# EAGLE design nandboard (EAGLE 7.2.0)
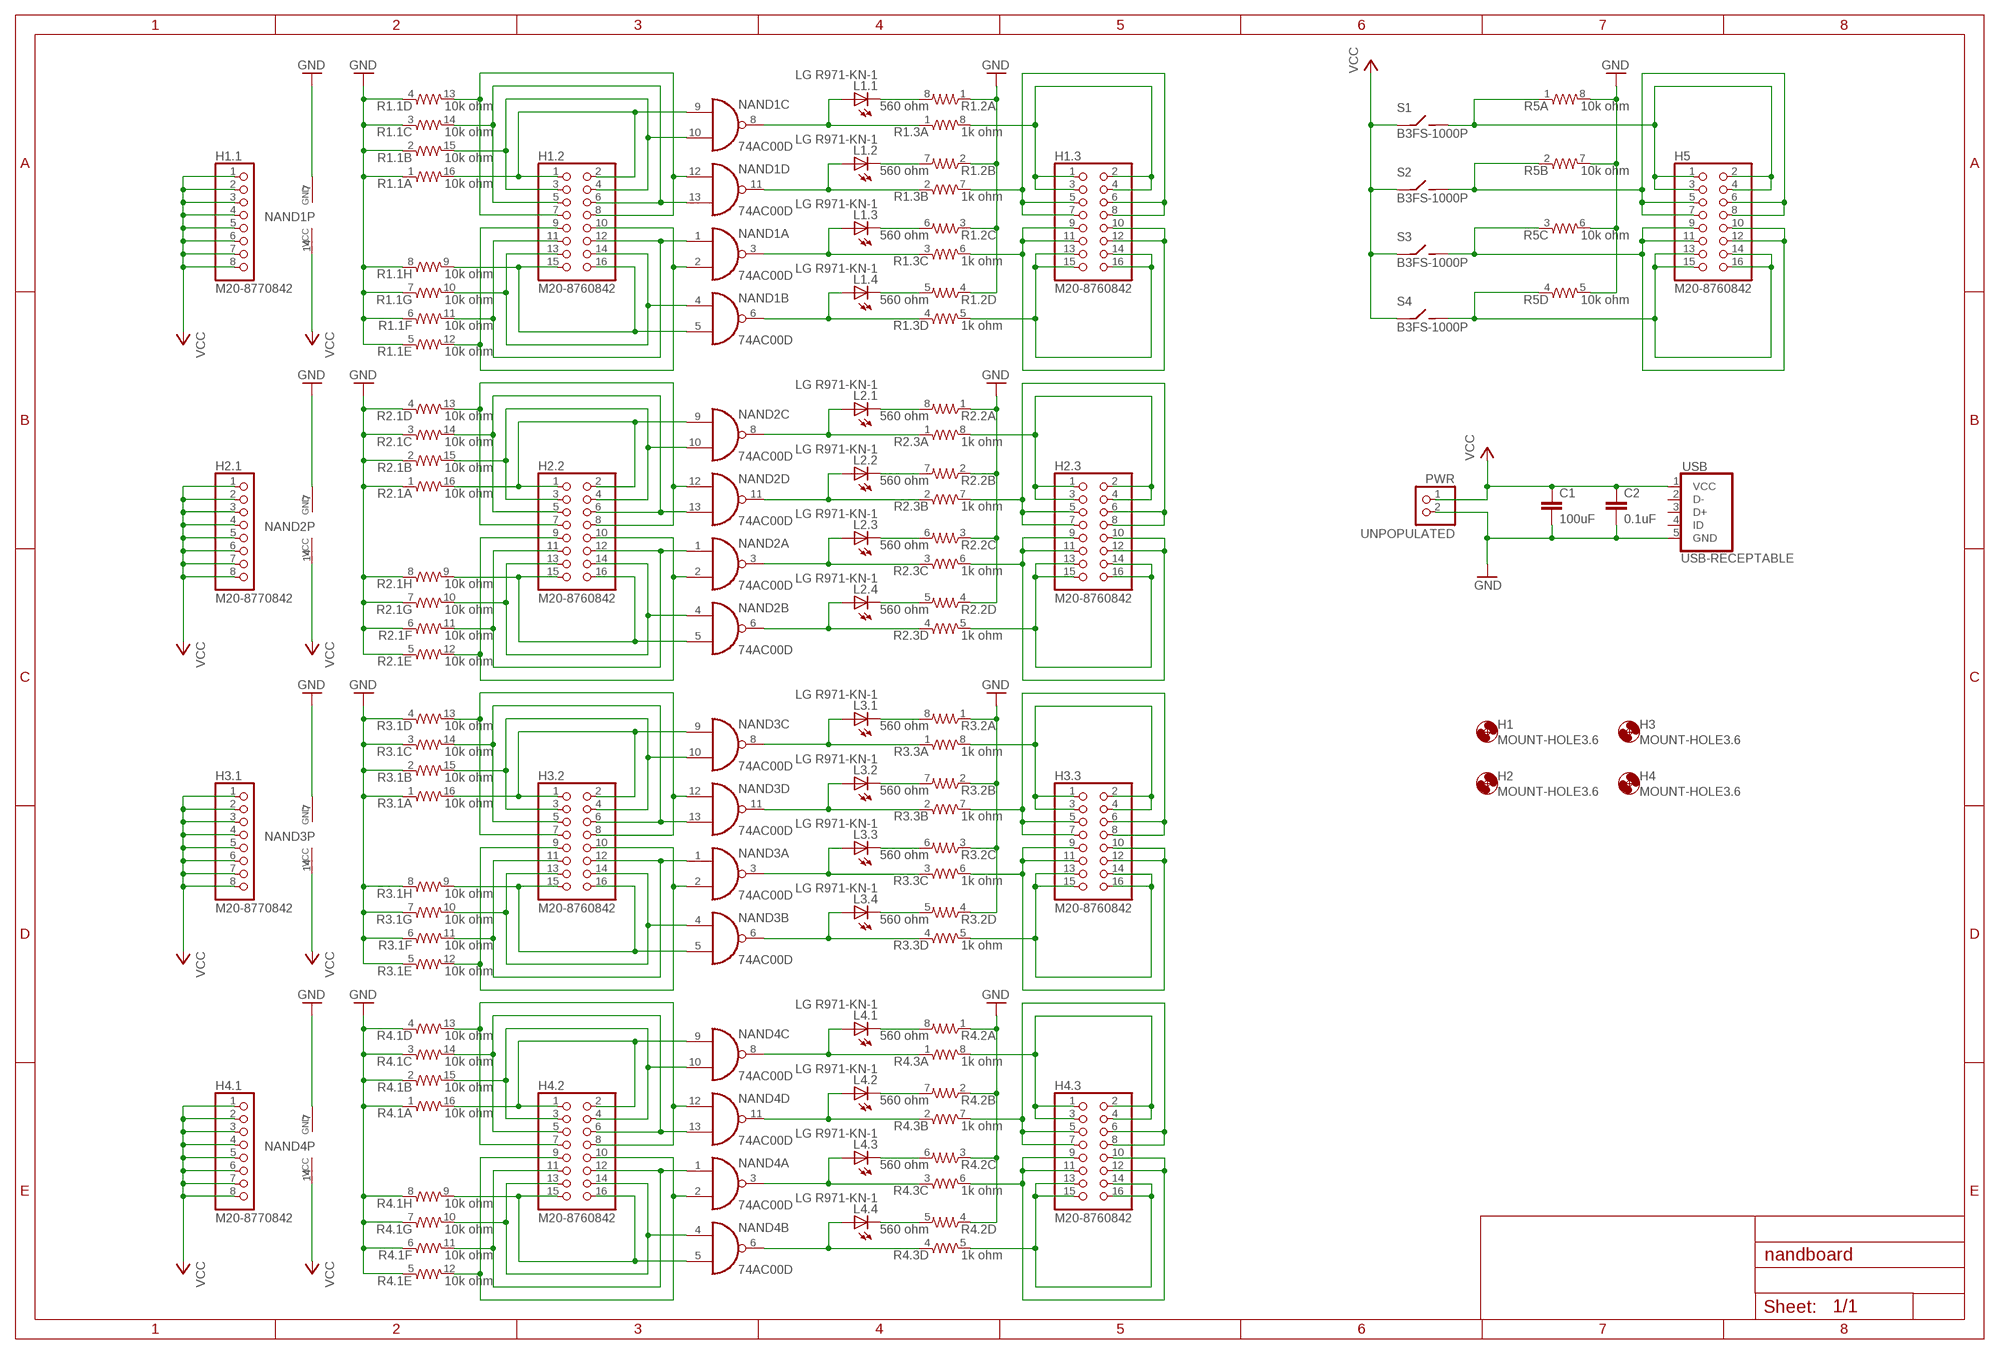
[diagram p0: schematic, sheet 1]

## Parts
C1  100uF  C-EUC1210  [C1210]
C2  0.1uF  C-EUC0805  [C0805]
H1  MOUNT-HOLE3.6  [3,6]
H1.1  M20-8770842  PINHD-1X81X08_SMT  [1X08_SMT]
H1.2  M20-8760842  PINHD-2X8SMT  [2X08_SMT]
H1.3  M20-8760842  PINHD-2X8SMT  [2X08_SMT]
H2  MOUNT-HOLE3.6  [3,6]
H2.1  M20-8770842  PINHD-1X81X08_SMT  [1X08_SMT]
H2.2  M20-8760842  PINHD-2X8SMT  [2X08_SMT]
H2.3  M20-8760842  PINHD-2X8SMT  [2X08_SMT]
H3  MOUNT-HOLE3.6  [3,6]
H3.1  M20-8770842  PINHD-1X81X08_SMT  [1X08_SMT]
H3.2  M20-8760842  PINHD-2X8SMT  [2X08_SMT]
H3.3  M20-8760842  PINHD-2X8SMT  [2X08_SMT]
H4  MOUNT-HOLE3.6  [3,6]
H4.1  M20-8770842  PINHD-1X81X08_SMT  [1X08_SMT]
H4.2  M20-8760842  PINHD-2X8SMT  [2X08_SMT]
H4.3  M20-8760842  PINHD-2X8SMT  [2X08_SMT]
H5  M20-8760842  PINHD-2X8SMT  [2X08_SMT]
L1.1  LG R971-KN-1  LEDCHIPLED_0805  [CHIPLED_0805]
L1.2  LG R971-KN-1  LEDCHIPLED_0805  [CHIPLED_0805]
L1.3  LG R971-KN-1  LEDCHIPLED_0805  [CHIPLED_0805]
L1.4  LG R971-KN-1  LEDCHIPLED_0805  [CHIPLED_0805]
L2.1  LG R971-KN-1  LEDCHIPLED_0805  [CHIPLED_0805]
L2.2  LG R971-KN-1  LEDCHIPLED_0805  [CHIPLED_0805]
L2.3  LG R971-KN-1  LEDCHIPLED_0805  [CHIPLED_0805]
L2.4  LG R971-KN-1  LEDCHIPLED_0805  [CHIPLED_0805]
L3.1  LG R971-KN-1  LEDCHIPLED_0805  [CHIPLED_0805]
L3.2  LG R971-KN-1  LEDCHIPLED_0805  [CHIPLED_0805]
L3.3  LG R971-KN-1  LEDCHIPLED_0805  [CHIPLED_0805]
L3.4  LG R971-KN-1  LEDCHIPLED_0805  [CHIPLED_0805]
L4.1  LG R971-KN-1  LEDCHIPLED_0805  [CHIPLED_0805]
L4.2  LG R971-KN-1  LEDCHIPLED_0805  [CHIPLED_0805]
L4.3  LG R971-KN-1  LEDCHIPLED_0805  [CHIPLED_0805]
L4.4  LG R971-KN-1  LEDCHIPLED_0805  [CHIPLED_0805]
NAND1  74AC00D  [SO14]
NAND2  74AC00D  [SO14]
NAND3  74AC00D  [SO14]
NAND4  74AC00D  [SO14]
PWR  UNPOPULATED  PINHD-1X2  [1X02]
R1.1  10k ohm  742-16_S  [742-16]
R1.2  560 ohm  742-8_S  [742-8]
R1.3  1k ohm  742-8_S  [742-8]
R2.1  10k ohm  742-16_S  [742-16]
R2.2  560 ohm  742-8_S  [742-8]
R2.3  1k ohm  742-8_S  [742-8]
R3.1  10k ohm  742-16_S  [742-16]
R3.2  560 ohm  742-8_S  [742-8]
R3.3  1k ohm  742-8_S  [742-8]
R4.1  10k ohm  742-16_S  [742-16]
R4.2  560 ohm  742-8_S  [742-8]
R4.3  1k ohm  742-8_S  [742-8]
R5  10k ohm  742-8_S  [742-8]
S1  B3FS-1000P  SPSTB3FS-1000  [B3FS-1000]
S2  B3FS-1000P  SPSTB3FS-1000  [B3FS-1000]
S3  B3FS-1000P  SPSTB3FS-1000  [B3FS-1000]
S4  B3FS-1000P  SPSTB3FS-1000  [B3FS-1000]
USB  USB-RECEPTABLE  [FCI-10103594-0001LF]

## Nets
GND: C1.2 C2.2 NAND1.7(P:GND) NAND2.7(P:GND) NAND3.7(P:GND) NAND4.7(P:GND) PWR.2 R1.1.1 R1.1.2 R1.1.3 R1.1.4 R1.1.5 R1.1.6 R1.1.7 R1.1.8 R1.2.1 R1.2.2 R1.2.3 R1.2.4 R2.1.1 R2.1.2 R2.1.3 R2.1.4 R2.1.5 R2.1.6 R2.1.7 R2.1.8 R2.2.1 R2.2.2 R2.2.3 R2.2.4 R3.1.1 R3.1.2 R3.1.3 R3.1.4 R3.1.5 R3.1.6 R3.1.7 R3.1.8 R3.2.1 R3.2.2 R3.2.3 R3.2.4 R4.1.1 R4.1.2 R4.1.3 R4.1.4 R4.1.5 R4.1.6 R4.1.7 R4.1.8 R4.2.1 R4.2.2 R4.2.3 R4.2.4 R5.5 R5.6 R5.7 R5.8 USB.5(GND)
N$1: H2.2.1 H2.2.2 NAND2.9(C:I0) R2.1.16
N$2: H2.2.3 H2.2.4 NAND2.10(C:I1) R2.1.15
N$3: H5.1 H5.2 H5.3 H5.4 R5.1 S1.3(B) S1.4(B)
N$4: H2.2.5 H2.2.6 NAND2.13(D:I1) R2.1.14
N$5: H2.2.7 H2.2.8 NAND2.12(D:I0) R2.1.13
N$6: H5.5 H5.6 H5.7 H5.8 R5.2 S2.3(B) S2.4(B)
N$7: H5.9 H5.10 H5.11 H5.12 R5.3 S3.3(B) S3.4(B)
N$8: H5.13 H5.14 H5.15 H5.16 R5.4 S4.3(B) S4.4(B)
N$9: H2.2.15 H2.2.16 NAND2.5(B:I1) R2.1.9
N$10: H2.2.13 H2.2.14 NAND2.4(B:I0) R2.1.10
N$11: H2.2.11 H2.2.12 NAND2.1(A:I0) R2.1.11
N$12: H2.2.9 H2.2.10 NAND2.2(A:I1) R2.1.12
N$13: L1.4.C R1.2.5
N$14: L1.3.C R1.2.6
N$15: L1.2.C R1.2.7
N$16: L1.1.C R1.2.8
N$17: H2.3.13 H2.3.14 H2.3.15 H2.3.16 R2.3.5
N$18: H2.3.9 H2.3.10 H2.3.11 H2.3.12 R2.3.6
N$19: H2.3.1 H2.3.2 H2.3.3 H2.3.4 R2.3.8
N$20: H2.3.5 H2.3.6 H2.3.7 H2.3.8 R2.3.7
N$21: H1.2.1 H1.2.2 NAND1.9(C:I0) R1.1.16
N$22: H1.2.3 H1.2.4 NAND1.10(C:I1) R1.1.15
N$23: H1.2.5 H1.2.6 NAND1.13(D:I1) R1.1.14
N$24: H1.2.7 H1.2.8 NAND1.12(D:I0) R1.1.13
N$25: H1.3.13 H1.3.14 H1.3.15 H1.3.16 R1.3.5
N$26: H1.3.9 H1.3.10 H1.3.11 H1.3.12 R1.3.6
N$27: L1.1.A NAND1.8(C:O) R1.3.1
N$28: H1.3.1 H1.3.2 H1.3.3 H1.3.4 R1.3.8
N$29: H1.2.15 H1.2.16 NAND1.5(B:I1) R1.1.9
N$30: H1.2.13 H1.2.14 NAND1.4(B:I0) R1.1.10
N$31: H1.2.11 H1.2.12 NAND1.1(A:I0) R1.1.11
N$32: H1.2.9 H1.2.10 NAND1.2(A:I1) R1.1.12
N$33: L1.2.A NAND1.11(D:O) R1.3.2
N$34: H1.3.5 H1.3.6 H1.3.7 H1.3.8 R1.3.7
N$35: L1.3.A NAND1.3(A:O) R1.3.3
N$36: L1.4.A NAND1.6(B:O) R1.3.4
N$37: L2.1.A NAND2.8(C:O) R2.3.1
N$38: L2.2.A NAND2.11(D:O) R2.3.2
N$39: L2.3.A NAND2.3(A:O) R2.3.3
N$40: L2.4.A NAND2.6(B:O) R2.3.4
N$41: L2.1.C R2.2.8
N$42: L2.2.C R2.2.7
N$43: L2.3.C R2.2.6
N$44: L2.4.C R2.2.5
N$45: H3.2.1 H3.2.2 NAND3.9(C:I0) R3.1.16
N$46: H3.2.3 H3.2.4 NAND3.10(C:I1) R3.1.15
N$47: H3.2.5 H3.2.6 NAND3.13(D:I1) R3.1.14
N$48: H3.2.7 H3.2.8 NAND3.12(D:I0) R3.1.13
N$49: H3.2.15 H3.2.16 NAND3.5(B:I1) R3.1.9
N$50: H3.2.13 H3.2.14 NAND3.4(B:I0) R3.1.10
N$51: H3.2.11 H3.2.12 NAND3.1(A:I0) R3.1.11
N$52: H3.2.9 H3.2.10 NAND3.2(A:I1) R3.1.12
N$53: H3.3.13 H3.3.14 H3.3.15 H3.3.16 R3.3.5
N$54: H3.3.9 H3.3.10 H3.3.11 H3.3.12 R3.3.6
N$55: H3.3.1 H3.3.2 H3.3.3 H3.3.4 R3.3.8
N$56: H3.3.5 H3.3.6 H3.3.7 H3.3.8 R3.3.7
N$57: L3.1.A NAND3.8(C:O) R3.3.1
N$58: L3.2.A NAND3.11(D:O) R3.3.2
N$59: L3.3.A NAND3.3(A:O) R3.3.3
N$60: L3.4.A NAND3.6(B:O) R3.3.4
N$61: L3.4.C R3.2.5
N$62: L3.3.C R3.2.6
N$63: L3.2.C R3.2.7
N$64: L3.1.C R3.2.8
N$65: H4.2.1 H4.2.2 NAND4.9(C:I0) R4.1.16
N$66: H4.2.3 H4.2.4 NAND4.10(C:I1) R4.1.15
N$67: H4.2.5 H4.2.6 NAND4.13(D:I1) R4.1.14
N$68: H4.2.7 H4.2.8 NAND4.12(D:I0) R4.1.13
N$69: H4.2.15 H4.2.16 NAND4.5(B:I1) R4.1.9
N$70: H4.2.13 H4.2.14 NAND4.4(B:I0) R4.1.10
N$71: H4.2.11 H4.2.12 NAND4.1(A:I0) R4.1.11
N$72: H4.2.9 H4.2.10 NAND4.2(A:I1) R4.1.12
N$73: H4.3.13 H4.3.14 H4.3.15 H4.3.16 R4.3.5
N$74: H4.3.9 H4.3.10 H4.3.11 H4.3.12 R4.3.6
N$75: H4.3.1 H4.3.2 H4.3.3 H4.3.4 R4.3.8
N$76: H4.3.5 H4.3.6 H4.3.7 H4.3.8 R4.3.7
N$77: L4.1.A NAND4.8(C:O) R4.3.1
N$78: L4.2.A NAND4.11(D:O) R4.3.2
N$79: L4.3.A NAND4.3(A:O) R4.3.3
N$80: L4.4.A NAND4.6(B:O) R4.3.4
N$81: L4.1.C R4.2.8
N$82: L4.2.C R4.2.7
N$83: L4.3.C R4.2.6
N$84: L4.4.C R4.2.5
VCC: C1.1 C2.1 H1.1.1 H1.1.2 H1.1.3 H1.1.4 H1.1.5 H1.1.6 H1.1.7 H1.1.8 H2.1.1 H2.1.2 H2.1.3 H2.1.4 H2.1.5 H2.1.6 H2.1.7 H2.1.8 H3.1.1 H3.1.2 H3.1.3 H3.1.4 H3.1.5 H3.1.6 H3.1.7 H3.1.8 H4.1.1 H4.1.2 H4.1.3 H4.1.4 H4.1.5 H4.1.6 H4.1.7 H4.1.8 NAND1.14(P:VCC) NAND2.14(P:VCC) NAND3.14(P:VCC) NAND4.14(P:VCC) PWR.1 S1.1(A) S1.2(A) S2.1(A) S2.2(A) S3.1(A) S3.2(A) S4.1(A) S4.2(A) USB.1(VCC)
Unconnected: USB.2(D-) USB.3(D+) USB.4(ID)

## Library data of the parts
C1 C2 = rcl:C-EU: CAPACITOR, European symbol
H1-H4 = holes:MOUNT-HOLE: MOUNTING HOLE with drill center marker
H1.1 H2.1 H3.1 H4.1 = pinhead+:PINHD-1X8: PIN HEADER
H1.2 H1.3 H2.2 H2.3 H3.2 H3.3 H4.2 H4.3 H5 = pinhead+:PINHD-2X8: PIN HEADER
L1.1-L1.4 L2.1-L2.4 L3.1-L3.4 L4.1-L4.4 = led:LED: LED OSRAM: - CHIPLED LG R971, LG N971, LY N971, LG Q971, LY Q971, LO R971, LY R971 LH N974, LH R974 LS Q976, LO Q976, LY Q976 LO Q996 - Hyper CHIPLED LW Q18S LB Q993, LB Q99A, LB R99A - SideLED LS A670, LO A670, LY A670, LG A670, LP A670 LB A673, LV A673, LT A673, LW A673 LH A674 LY A675 LS A676, LA A676, LO A676, LY A676, LW A676 LS A679, LY A679, LG A679 - Hyper Micro SIDELED® LS Y876, LA Y876, LO Y876, LY Y876 LT Y87S - SmartLED LW L88C, LW L88S LB L89C, LB L89S, LG L890 LS L89K, LO L89K, LY L89K LS L896, LA L896, LO L896, LY L896 - TOPLED LS T670, LO T670, LY T670, LG T670, LP T670 LSG T670, LSP T670, LSY T670, LOP T670, LYG T670 LG T671, LOG T671, LSG T671 LB T673, LV T673, LT T673, LW T673 LH T674 LS T676, LA T676, LO T676, LY T676, LB T676, LH T676, LSB T676, LW T676 LB T67C, LV T67C, LT T67C, LS T67K, LO T67K, LY T67K, LW E67C LS E67B, LA E67B, LO E67B, LY E67B, LB E67C, LV E67C, LT E67C LW T67C LS T679, LY T679, LG T679 LS T770, LO T770, LY T770, LG T770, LP T770 LB T773, LV T773, LT T773, LW T773 LH T774 LS E675, LA E675, LY E675, LS T675 LS T776, LA T776, LO T776, LY T776, LB T776 LHGB T686 LT T68C, LB T68C - Hyper Mini TOPLED® LB M676 - Mini TOPLED Santana® LG M470 LS M47K, LO M47K, LY M47K Source: http://www.osram.convergy.de LUXEON: - LUMILED® LXK2-PW12-R00, LXK2-PW12-S00, LXK2-PW14-U00, LXK2-PW14-V00 LXK2-PM12-R00, LXK2-PM12-S00, LXK2-PM14-U00 LXK2-PE12-Q00, LXK2-PE12-R00, LXK2-PE12-S00, LXK2-PE14-T00, LXK2-PE14-U00 LXK2-PB12-K00, LXK2-PB12-L00, LXK2-PB12-M00, LXK2-PB14-N00, LXK2-PB14-P00, LXK2-PB14-Q00 LXK2-PR12-L00, LXK2-PR12-M00, LXK2-PR14-Q00, LXK2-PR14-R00 LXK2-PD12-Q00, LXK2-PD12-R00, LXK2-PD12-S00 LXK2-PH12-R00, LXK2-PH12-S00 LXK2-PL12-P00, LXK2-PL12-Q00, LXK2-PL12-R00 Source: www.luxeon.com KINGBRIGHT: KA-3528ASYC Source: www.kingbright.com
NAND1-NAND4 = 74xx-eu:74*00: Quad 2-input NAND gate
PWR = pinhead:PINHD-1X2: PIN HEADER
R1.1 R2.1 R3.1 R4.1 = resistor-array:742-16_S: CTS 742 Series 16 Terminations, 8 Resistors
R1.2 R1.3 R2.2 R2.3 R3.2 R3.3 R4.2 R4.3 R5 = resistor-array:742-8_S: CTS 742 Series 8 Terminations, 4 Resistors
S1-S4 = PP_Electromechanical:SPST: SPST Switches
USB = daspilker:USB-RECEPTABLE: USB Receptable

## Board
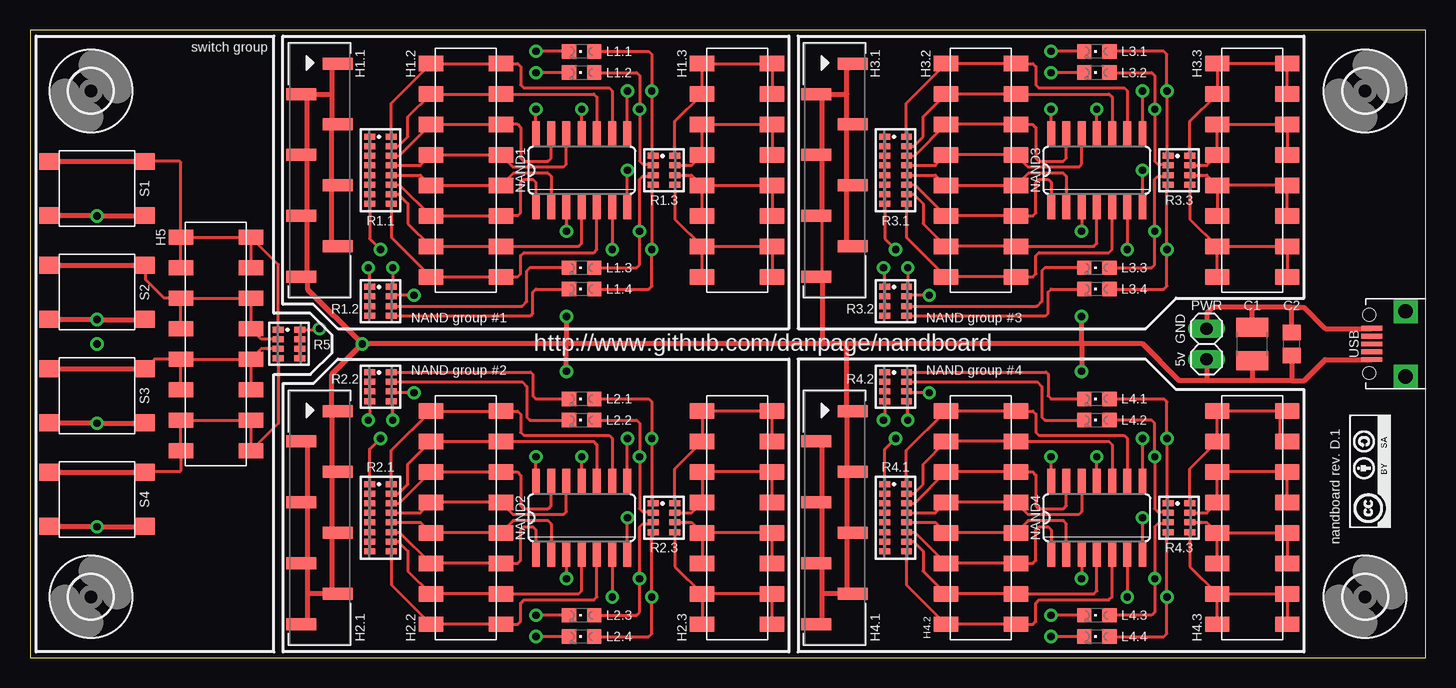
[diagram p1: board, top side]
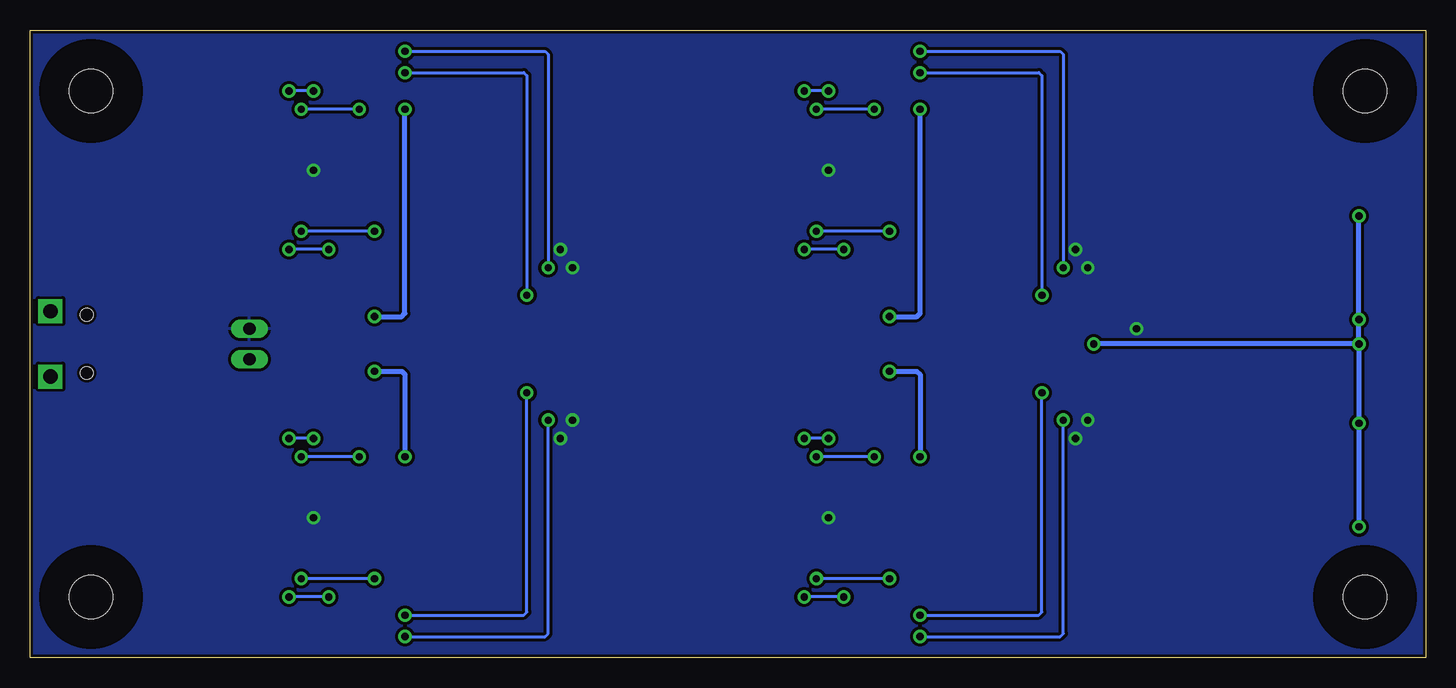
[diagram p2: board, bottom side, seen from below]

Size 116.33 x 52.32 mm. Coordinates in mm from the lower left corner, seen from the top.
Outline: 0,0 116.33,0 116.33,52.32 0,52.32 0,0
Copper layers (1*16): Top 0.035mm / dielectric 1.5mm / Bottom 0.035mm
Design rules "pcbtrain": minimum track width 0.2mm, minimum drill 0.4mm, track to track 0.2mm, track to pad 0.2mm, pad to pad 0.2mm, via to via 0.2mm, smd to smd 0mil, copper to edge 10mil, drill to drill 0.2mm, minimum pad ring 10mil, minimum via ring 10mil, stop-mask expansion 0.125mm, vias tented up to drill 0mil, thermal gap 10mil

### Footprints (pad centres in the part's own frame; a part is rotated, then mirrored left to right if it is on the bottom)
C1210 = smd 1.6 x 2.7: 1 -1.4,0; 2 1.4,0
C0805 = smd 1.3 x 1.5: 1 -0.95,0; 2 0.95,0
3,6 = hole 3.6: 0,0
1X08_SMT = smd 1 x 2.5: 1 -8.89,1.52; 2 -6.35,-1.52; 3 -3.81,1.52; 4 -1.27,-1.52; 5 1.27,1.52; 6 3.81,-1.52; 7 6.35,1.52; 8 8.89,-1.52
2X08_SMT = smd 1.27 x 2.032: 1 -8.89,-2.921; 2 -8.89,2.921; 3 -6.35,-2.921; 4 -6.35,2.921; 5 -3.81,-2.921; 6 -3.81,2.921; 7 -1.27,-2.921; 8 -1.27,2.921; 9 1.27,-2.921; 10 1.27,2.921; 11 3.81,-2.921; 12 3.81,2.921; 13 6.35,-2.921; 14 6.35,2.921; 15 8.89,-2.921; 16 8.89,2.921
CHIPLED_0805 = smd 1.2 x 1.2: A 0,-1.05; C 0,1.05
SO14 = smd 0.66 x 2.032: 1 -3.81,-3.073; 2 -2.54,-3.073; 3 -1.27,-3.073; 4 0,-3.073; 5 1.27,-3.073; 6 2.54,-3.073; 7 3.81,-3.073; 8 3.81,3.073; 9 2.54,3.073; 10 1.27,3.073; 11 0,3.073; 12 -1.27,3.073; 13 -2.54,3.073; 14 -3.81,3.073
1X02 = drill 1.016 long: 1 -1.27,0; 2 1.27,0
742-16 = smd 0.5 x 0.9: 1 -2.8,-0.9; 2 -2,-0.9; 3 -1.2,-0.9; 4 -0.4,-0.9; 5 0.4,-0.9; 6 1.2,-0.9; 7 2,-0.9; 8 2.8,-0.9; 9 2.8,0.9; 10 2,0.9; 11 1.2,0.9; 12 0.4,0.9; 13 -0.4,0.9; 14 -1.2,0.9; 15 -2,0.9; 16 -2.8,0.9
742-8 = smd 0.5 x 0.9: 1 -1.2,-0.9; 2 -0.4,-0.9; 3 0.4,-0.9; 4 1.2,-0.9; 5 1.2,0.9; 6 0.4,0.9; 7 -0.4,0.9; 8 -1.2,0.9
B3FS-1000 = smd 1.6 x 1.4: 1 4,-2.25; 2 -4,-2.25; 3 4,2.25; 4 -4,2.25
FCI-10103594-0001LF = smd 0.4 x 1.75: 1 -1.3,4.525; 2 -0.65,4.525; 3 0,4.525; 4 0.65,4.525; 5 1.3,4.525 | drill 1.2 pad 2 square: P$3 -2.725,1.7; P$4 2.725,1.7 | hole 1.05: -2.425,4.73; 2.425,4.73

### Placement (x,y rotation side)
C1  101.85,26.16 90 top
C2  105.16,26.16 90 top
H1  5.08,5.08 0 top
H1.1  24.13,40.64 270 top
H1.2  36.32,40.64 270 top
H1.3  58.93,40.64 270 top
H2  5.08,47.24 0 top
H2.1  24.13,11.68 270 top
H2.2  36.32,11.68 270 top
H2.3  58.93,11.68 270 top
H3  111.25,5.08 0 top
H3.1  67.06,40.64 270 top
H3.2  79.25,40.64 270 top
H3.3  101.85,40.64 270 top
H4  111.25,47.24 0 top
H4.1  67.06,11.68 270 top
H4.2  79.25,11.68 270 top
H4.3  101.85,11.68 270 top
H5  15.49,26.16 270 top
L1.1  45.97,50.55 90 top
L1.2  45.97,48.77 90 top
L1.3  45.97,32.51 90 top
L1.4  45.97,30.73 90 top
L2.1  45.97,21.59 90 top
L2.2  45.97,19.81 90 top
L2.3  45.97,3.56 90 top
L2.4  45.97,1.78 90 top
L3.1  88.9,50.55 90 top
L3.2  88.9,48.77 90 top
L3.3  88.9,32.51 90 top
L3.4  88.9,30.73 90 top
L4.1  88.9,21.59 90 top
L4.2  88.9,19.81 90 top
L4.3  88.9,3.56 90 top
L4.4  88.9,1.78 90 top
NAND1  45.97,40.64 0 top
NAND2  45.97,11.68 0 top
NAND3  88.9,40.64 0 top
NAND4  88.9,11.68 0 top
PWR  98.04,26.16 90 top
R1.1  29.21,40.64 270 top
R1.2  29.21,29.72 270 top
R1.3  52.83,40.64 270 top
R2.1  29.21,11.68 270 top
R2.2  29.21,22.61 270 top
R2.3  52.83,11.68 270 top
R3.1  72.14,40.64 270 top
R3.2  72.14,29.72 270 top
R3.3  95.76,40.64 270 top
R4.1  72.14,11.68 270 top
R4.2  72.14,22.61 270 top
R4.3  95.76,11.68 270 top
R5  21.59,26.16 270 top
S1  5.59,39.12 0 top
S2  5.59,30.48 0 top
S3  5.59,21.84 0 top
S4  5.59,13.21 0 top
USB  116.33,26.16 90 top

### Tracks (layer width: path | path; a pad name or v marks a point on that pad's centre or on a via)
GND  (via drill 0.6)
  Top 0.254: NAND1.7 v49.78,40.64 | NAND3.7 v92.71,40.64 | NAND4.7 v92.71,11.68 | NAND2.7 v49.78,11.68 | v28.19,19.81 28.31,19.93 R2.2.4 R2.2.3 R2.2.2 R2.2.1 | R2.1.8 R2.1.7 R2.1.6 R2.1.5 R2.1.4 R2.1.3 R2.1.2 R2.1.1 28.31,17.39 v29.21,18.29 | R4.1.8 R4.1.7 R4.1.6 R4.1.5 R4.1.4 R4.1.3 R4.1.2 R4.1.1 71.24,17.39 v72.14,18.29 | R4.2.1 R4.2.2 R4.2.3 R4.2.4 71.24,19.93 v71.12,19.81 | R1.2.4 R1.2.3 R1.2.2 R1.2.1 28.31,32.4 v28.19,32.51 | R1.1.1 R1.1.2 R1.1.3 R1.1.4 R1.1.5 R1.1.6 R1.1.7 R1.1.8 28.31,34.94 v29.21,34.04 | R5.5 R5.6 R5.7 R5.8 24.06,27.36 v24.13,27.43 | R3.2.4 R3.2.3 R3.2.2 R3.2.1 71.24,32.4 v71.12,32.51 | v72.14,34.04 71.24,34.94 R3.1.8 R3.1.7 R3.1.6 R3.1.5 R3.1.4 R3.1.3 R3.1.2 R3.1.1
  Top 0.406: 105.16,29.21 101.85,29.21 | C2.2 105.16,29.21 | C1.2 101.85,29.21 | 101.85,29.21 98.55,29.21 98.04,28.7 PWR.2 | 105.16,29.21 106.17,29.21 107.95,27.43 111.78,27.43 USB.5
  pour Bottom (isolate 0.254): 0.25,0.25 0.25,52.07 116.08,52.07 116.08,0.25
N$1
  Top 0.254: NAND2.9 48.51,18.29 48.26,18.54 41.15,18.54 40.89,18.8 40.89,20.32 40.64,20.57 H2.2.2 H2.2.1 30.11,17.28 R2.1.16
N$2
  Top 0.254: NAND2.10 47.24,17.78 46.99,18.03 H2.2.4 H2.2.3 31.5,16.13 31.5,14.48 30.7,13.68 R2.1.15
N$3
  Top 0.254: H5.3 H5.1 | H5.1 H5.2 | H5.2 H5.4 | R5.1 20.69,32.78 H5.2 | H5.1 12.57,41.27 12.45,41.4 9.62,41.4 S1.3
  Top 0.406: S1.4 S1.3
N$4
  Top 0.254: NAND2.13 43.43,12.7 43.18,12.45 41.15,12.45 40.89,12.7 40.89,15.24 40.64,15.49 H2.2.6 H2.2.5 30.79,12.88 R2.1.14
N$5
  Top 0.254: NAND2.12 44.7,12.19 44.45,11.94 40.26,11.94 H2.2.8 H2.2.7 32.53,12.08 R2.1.13
N$6
  Top 0.254: H5.7 H5.5 | H5.5 H5.6 H5.8 19.29,26.56 R5.2 | H5.5 11.18,29.97 9.65,31.5 9.65,32.67 S2.3
  Top 0.406: S2.4 S2.3
N$7
  Top 0.254: H5.11 H5.9 | H5.9 H5.10 | H5.10 H5.12 | R5.3 19.29,25.76 H5.10 | 9.62,24.13 S3.3 10.39,24.89 H5.9
  Top 0.406: S3.4 S3.3
N$8
  Top 0.254: R5.4 20.69,19.55 H5.16 H5.14 H5.13 H5.15 12.57,15.62 12.45,15.49 9.62,15.49 S4.3
  Top 0.406: S4.4 S4.3
N$9
  Top 0.254: NAND2.5 47.24,5.08 46.99,4.83 41.15,4.83 40.89,4.57 40.89,3.05 40.64,2.79 H2.2.16 H2.2.15 30.11,6.08 R2.1.9
N$10
  Top 0.254: NAND2.4 45.97,5.59 45.72,5.33 H2.2.14 H2.2.13 31.5,7.24 31.5,8.89 30.7,9.68 R2.1.10
N$11
  Top 0.254: NAND2.1 42.16,10.67 41.91,10.92 41.15,10.92 40.89,10.67 40.89,8.13 40.64,7.87 H2.2.12 H2.2.11 30.79,10.48 R2.1.11
N$12
  Top 0.254: NAND2.2 43.43,11.18 43.18,11.43 40.26,11.43 H2.2.10 H2.2.9 32.53,11.28 R2.1.12
N$13
  Top 0.254: R1.2.5 41.73,28.52 41.91,28.7 41.91,30.48 42.16,30.73 L1.4.C
N$14
  Top 0.254: L1.3.C 41.66,32.51 41.4,32.26 41.4,29.72 41,29.32 R1.2.6
N$15  (via drill 0.6)
  Top 0.254: L1.2.C v42.16,48.77 | v32,30.23 30.22,30.23 R1.2.7
  Bottom 0.254: v42.16,48.77 32.26,48.77 32,48.51 v32,30.23
N$16  (via drill 0.6)
  Top 0.254: L1.1.C v42.16,50.55 | v30.23,32.51 30.23,31.03 R1.2.8
  Bottom 0.254: v42.16,50.55 30.48,50.55 30.23,50.29 v30.23,32.51
N$17
  Top 0.254: H2.3.16 H2.3.14 H2.3.13 | H2.3.13 H2.3.15 | R2.3.5 53.73,7.61 H2.3.13
N$18
  Top 0.254: H2.3.12 H2.3.10 H2.3.9 | H2.3.9 H2.3.11 | R2.3.6 55.14,11.28 H2.3.9
N$19
  Top 0.254: H2.3.4 H2.3.2 H2.3.1 H2.3.3 53.73,15.76 R2.3.8
N$20
  Top 0.254: H2.3.8 H2.3.6 H2.3.5 H2.3.7 55.14,12.08 R2.3.7
N$21
  Top 0.254: NAND1.9 48.51,47.24 48.26,47.5 41.15,47.5 40.89,47.75 40.89,49.28 40.64,49.53 H1.2.2 H1.2.1 30.11,46.24 R1.1.16
N$22
  Top 0.254: NAND1.10 47.24,46.74 46.99,46.99 H1.2.4 H1.2.3 31.5,45.09 31.5,43.43 30.7,42.64 R1.1.15
N$23
  Top 0.254: 39.88,44.45 H1.2.6 H1.2.5 30.79,41.84 R1.1.14 | 39.88,44.45 39.88,44.2 | NAND1.13 43.43,41.66 43.18,41.4 41.15,41.4 40.89,41.66 40.89,44.2 40.64,44.45 39.88,44.45
N$24
  Top 0.254: NAND1.12 44.7,41.15 44.45,40.89 40.26,40.89 H1.2.8 H1.2.7 32.53,41.04 R1.1.13
N$25
  Top 0.254: H1.3.15 H1.3.13 | H1.3.13 H1.3.14 H1.3.16 | R1.3.5 53.73,36.56 H1.3.13
N$26
  Top 0.254: H1.3.11 H1.3.9 | H1.3.9 H1.3.10 H1.3.12 | R1.3.6 55.14,40.24 H1.3.9
N$27  (via drill 0.6)
  Top 0.254: NAND1.8 v49.78,47.24 | L1.1.A 51.56,50.55 51.82,50.29 v51.82,47.24 51.82,41.96 R1.3.1
  Bottom 0.254: v49.78,47.24 v51.82,47.24
N$28
  Top 0.254: H1.3.4 H1.3.2 H1.3.1 H1.3.3 53.73,44.72 R1.3.8
N$29
  Top 0.254: NAND1.5 47.24,34.04 46.99,33.78 41.15,33.78 40.89,33.53 40.89,32 40.64,31.75 H1.2.16 H1.2.15 30.11,35.04 R1.1.9
N$30
  Top 0.254: NAND1.4 45.97,34.54 45.72,34.29 H1.2.14 H1.2.13 31.5,36.2 31.5,37.85 30.7,38.64 R1.1.10
N$31
  Top 0.254: H1.2.12 H1.2.11 30.79,39.44 R1.1.11 | H1.2.12 39.62,36.83 | NAND1.1 42.16,39.62 41.91,39.88 41.15,39.88 40.89,39.62 40.89,37.08 40.64,36.83 H1.2.12
N$32
  Top 0.254: NAND1.2 43.43,40.13 43.18,40.39 40.26,40.39 H1.2.10 H1.2.9 32.53,40.24 R1.1.12
N$33  (via drill 0.6)
  Top 0.254: NAND1.11 v45.97,45.72 | L1.2.A 50.55,48.77 50.8,48.51 v50.8,45.72 50.8,41.4 51.05,41.15 51.82,41.15 R1.3.2
  Bottom 0.254: v45.97,45.72 v50.8,45.72
N$34
  Top 0.254: H1.3.8 H1.3.6 H1.3.5 H1.3.7 55.14,41.04 R1.3.7
N$35  (via drill 0.6)
  Top 0.254: NAND1.3 v44.7,35.56 | 47.15,32.51 L1.3.A 50.55,32.51 50.8,32.77 v50.8,35.56 50.8,39.88 51.05,40.13 51.82,40.13 R1.3.3
  Bottom 0.254: v44.7,35.56 v50.8,35.56
N$36  (via drill 0.6)
  Top 0.254: NAND1.6 v48.51,34.04 | R1.3.4 51.8,39.31 51.8,34.3 v51.82,34.04 51.82,30.99 51.56,30.73 L1.4.A
  Bottom 0.254: v48.51,34.04 v51.82,34.04
N$37  (via drill 0.6)
  Top 0.254: NAND2.8 v49.78,18.29 | 51.8,18.02 v51.82,18.29 | v51.82,18.29 51.82,21.34 51.56,21.59 L2.1.A | v51.82,18.29 51.82,13 R2.3.1
  Bottom 0.254: v49.78,18.29 v51.82,18.29
N$38  (via drill 0.6)
  Top 0.254: NAND2.11 v45.97,16.76 | L2.2.A 50.55,19.81 50.8,19.56 v50.8,16.76 50.8,12.45 51.05,12.19 51.82,12.19 R2.3.2
  Bottom 0.254: v45.97,16.76 v50.8,16.76
N$39  (via drill 0.6)
  Top 0.254: NAND2.3 v44.7,6.6 | L2.3.A 50.55,3.56 50.8,3.81 v50.8,6.6 50.8,10.92 51.05,11.18 51.82,11.18 R2.3.3
  Bottom 0.254: v44.7,6.6 v50.8,6.6
N$40  (via drill 0.6)
  Top 0.254: NAND2.6 v48.51,5.08 | L2.4.A 51.56,1.78 51.82,2.03 v51.82,5.08 51.82,10.37 R2.3.4
  Bottom 0.254: v48.51,5.08 v51.82,5.08
N$41
  Top 0.254: R2.2.8 41.73,23.81 41.91,23.62 41.91,21.84 42.16,21.59 L2.1.C
N$42
  Top 0.254: L2.2.C 41.66,19.81 41.4,20.07 41.4,22.61 41,23.01 R2.2.7
N$43  (via drill 0.6)
  Top 0.254: L2.3.C v42.16,3.56 | v32,22.1 30.22,22.1 R2.2.6
  Bottom 0.254: v42.16,3.56 32.26,3.56 32,3.81 v32,22.1
N$44  (via drill 0.6)
  Top 0.254: L2.4.C v42.16,1.78 | v30.23,19.81 30.23,21.29 R2.2.5
  Bottom 0.254: v42.16,1.78 30.48,1.78 30.23,2.03 v30.23,19.81
N$45
  Top 0.254: NAND3.9 91.44,47.24 91.19,47.5 84.07,47.5 83.82,47.75 83.82,49.28 83.57,49.53 H3.2.2 H3.2.1 73.04,46.24 R3.1.16
N$46
  Top 0.254: NAND3.10 90.17,46.74 89.92,46.99 H3.2.4 H3.2.3 74.42,45.09 74.42,43.43 73.63,42.64 R3.1.15
N$47
  Top 0.254: NAND3.13 86.36,41.66 86.11,41.4 84.07,41.4 83.82,41.66 83.82,44.2 83.57,44.45 H3.2.6 H3.2.5 73.72,41.84 R3.1.14
N$48
  Top 0.254: NAND3.12 87.63,41.15 87.38,40.89 83.19,40.89 H3.2.8 H3.2.7 75.46,41.04 R3.1.13
N$49
  Top 0.254: NAND3.5 90.17,34.04 89.92,33.78 84.07,33.78 83.82,33.53 83.82,32 83.57,31.75 H3.2.16 H3.2.15 73.04,35.04 R3.1.9
N$50
  Top 0.254: NAND3.4 88.9,34.54 88.65,34.29 H3.2.14 H3.2.13 74.42,36.2 74.42,37.85 73.63,38.64 R3.1.10
N$51
  Top 0.254: NAND3.1 85.09,39.62 84.84,39.88 84.07,39.88 83.82,39.62 83.82,37.08 83.57,36.83 H3.2.12 H3.2.11 73.72,39.44 R3.1.11
N$52
  Top 0.254: NAND3.2 86.36,40.13 86.11,40.39 83.19,40.39 H3.2.10 H3.2.9 75.46,40.24 R3.1.12
N$53
  Top 0.254: H3.3.15 H3.3.13 | H3.3.13 H3.3.14 H3.3.16 | R3.3.5 96.66,36.56 H3.3.13
N$54
  Top 0.254: H3.3.12 H3.3.10 H3.3.9 | H3.3.9 H3.3.11 | R3.3.6 98.06,40.24 H3.3.9
N$55
  Top 0.254: H3.3.4 H3.3.2 H3.3.1 H3.3.3 96.66,44.72 R3.3.8
N$56
  Top 0.254: H3.3.8 H3.3.6 H3.3.5 H3.3.7 98.06,41.04 R3.3.7
N$57  (via drill 0.6)
  Top 0.254: NAND3.8 v92.71,47.24 | v94.74,47.24 94.74,50.29 94.49,50.55 L3.1.A | 94.73,46.98 v94.74,47.24 | v94.74,47.24 94.74,41.96 R3.3.1
  Bottom 0.254: v92.71,47.24 v94.74,47.24
N$58  (via drill 0.6)
  Top 0.254: NAND3.11 v88.9,45.72 | L3.2.A 93.47,48.77 93.73,48.51 v93.73,45.72 93.73,41.4 93.98,41.15 94.75,41.15 R3.3.2
  Bottom 0.254: v88.9,45.72 v93.73,45.72
N$59  (via drill 0.6)
  Top 0.254: NAND3.3 v87.63,35.56 | L3.3.A 93.47,32.51 93.73,32.77 v93.73,35.56 93.73,39.88 93.98,40.13 94.75,40.13 R3.3.3
  Bottom 0.254: v87.63,35.56 v93.73,35.56
N$60  (via drill 0.6)
  Top 0.254: NAND3.6 v91.44,34.04 | L3.4.A 94.49,30.73 94.74,30.99 v94.74,34.04 94.74,39.32 R3.3.4
  Bottom 0.254: v91.44,34.04 v94.74,34.04
N$61
  Top 0.254: R3.2.5 84.65,28.52 84.84,28.7 84.84,30.48 85.09,30.73 L3.4.C
N$62
  Top 0.254: L3.3.C 84.58,32.51 84.33,32.26 84.33,29.72 83.93,29.32 R3.2.6
N$63  (via drill 0.6)
  Top 0.254: L3.2.C v85.09,48.77 | v74.93,30.23 73.14,30.23 R3.2.7
  Bottom 0.254: v85.09,48.77 75.18,48.77 74.93,48.51 v74.93,30.23
N$64  (via drill 0.6)
  Top 0.254: L3.1.C v85.09,50.55 | v73.15,32.51 73.15,31.03 R3.2.8
  Bottom 0.254: v85.09,50.55 73.41,50.55 73.15,50.29 v73.15,32.51
N$65
  Top 0.254: NAND4.9 91.44,18.29 91.19,18.54 84.07,18.54 83.82,18.8 83.82,20.32 83.57,20.57 H4.2.2 H4.2.1 73.04,17.28 R4.1.16
N$66
  Top 0.254: NAND4.10 90.17,17.78 89.92,18.03 H4.2.4 H4.2.3 74.42,16.13 74.42,14.48 73.63,13.68 R4.1.15
N$67
  Top 0.254: NAND4.13 86.36,12.7 86.11,12.45 84.07,12.45 83.82,12.7 83.82,15.24 83.57,15.49 H4.2.6 H4.2.5 73.72,12.88 R4.1.14
N$68
  Top 0.254: NAND4.12 87.63,12.19 87.38,11.94 83.19,11.94 H4.2.8 H4.2.7 75.46,12.08 R4.1.13
N$69
  Top 0.254: NAND4.5 90.17,5.08 89.92,4.83 84.07,4.83 83.82,4.57 83.82,3.05 83.57,2.79 H4.2.16 H4.2.15 73.04,6.08 R4.1.9
N$70
  Top 0.254: NAND4.4 88.9,5.59 88.65,5.33 H4.2.14 H4.2.13 74.42,7.24 74.42,8.89 73.63,9.68 R4.1.10
N$71
  Top 0.254: NAND4.1 85.09,10.67 84.84,10.92 84.07,10.92 83.82,10.67 83.82,8.13 83.57,7.87 H4.2.12 H4.2.11 73.72,10.48 R4.1.11
N$72
  Top 0.254: NAND4.2 86.36,11.18 86.11,11.43 83.19,11.43 H4.2.10 H4.2.9 75.46,11.28 R4.1.12
N$73
  Top 0.254: H4.3.15 H4.3.13 | H4.3.13 H4.3.14 H4.3.16 | R4.3.5 96.66,7.61 H4.3.13
N$74
  Top 0.254: H4.3.11 H4.3.9 | H4.3.9 H4.3.10 H4.3.12 | R4.3.6 98.06,11.28 H4.3.9
N$75
  Top 0.254: H4.3.4 104.14,18.16 104.14,20.57 H4.3.2 H4.3.1 H4.3.3 96.66,15.76 R4.3.8
N$76
  Top 0.254: H4.3.8 H4.3.6 H4.3.5 H4.3.7 98.06,12.08 R4.3.7
N$77  (via drill 0.6)
  Top 0.254: NAND4.8 v92.71,18.29 | v94.74,18.29 94.74,21.34 94.49,21.59 L4.1.A | 94.73,18.02 v94.74,18.29 | v94.74,18.29 94.74,13 R4.3.1
  Bottom 0.254: v92.71,18.29 v94.74,18.29
N$78  (via drill 0.6)
  Top 0.254: NAND4.11 v88.9,16.76 | L4.2.A 93.47,19.81 93.73,19.56 v93.73,16.76 93.73,12.45 93.98,12.19 94.75,12.19 R4.3.2
  Bottom 0.254: v88.9,16.76 v93.73,16.76
N$79  (via drill 0.6)
  Top 0.254: NAND4.3 v87.63,6.6 | L4.3.A 93.47,3.56 93.73,3.81 v93.73,6.6 93.73,10.92 93.98,11.18 94.75,11.18 R4.3.3
  Bottom 0.254: v87.63,6.6 v93.73,6.6
N$80  (via drill 0.6)
  Top 0.254: NAND4.6 v91.44,5.08 | L4.4.A 94.49,1.78 94.74,2.03 v94.74,5.08 94.74,10.37 R4.3.4
  Bottom 0.254: v91.44,5.08 v94.74,5.08
N$81
  Top 0.254: R4.2.8 84.65,23.81 84.84,23.62 84.84,21.84 85.09,21.59 L4.1.C
N$82
  Top 0.254: R4.2.7 83.93,23.01 84.33,22.61 84.33,20.07 84.58,19.81 L4.2.C
N$83  (via drill 0.6)
  Top 0.254: L4.3.C v85.09,3.56 | v74.93,22.1 73.18,22.1 R4.2.6
  Bottom 0.254: v85.09,3.56 75.18,3.56 74.93,3.81 v74.93,22.1
N$84  (via drill 0.6)
  Top 0.254: L4.4.C v85.09,1.78 | v73.15,19.81 73.15,21.27 R4.2.5
  Bottom 0.254: v85.09,1.78 73.41,1.78 73.15,2.03 v73.15,19.81
VCC  (via drill 0.6)
  Top 0.254: H3.1.8 66.04,31.75 66.04,36.83 H3.1.6 | H3.1.7 68.08,34.29 | H3.1.5 68.08,39.37 | H3.1.4 66.04,41.91 | H3.1.3 68.08,44.45 | H3.1.2 66.04,46.99 | H1.1.1 25.15,49.53 | H1.1.2 23.11,46.99 | H1.1.3 25.15,44.45 | H1.1.4 23.11,41.91 | H1.1.5 25.15,39.37 | H1.1.6 23.11,36.83 | H2.1.1 25.15,20.57 | H2.1.2 23.11,18.03 | H2.1.4 23.11,12.95 | H2.1.5 25.15,10.41 | H2.1.6 23.11,7.87 | H4.1.8 66.04,2.79 | H4.1.6 66.04,7.87 | H4.1.4 66.04,12.95 | H4.1.2 66.04,18.03 | NAND2.14 v42.16,16.76 | NAND4.14 v85.09,16.76 | NAND3.14 v85.09,45.72 | NAND1.14 v42.16,45.72 | H1.1.8
  Top 0.406: 105.16,23.11 101.85,23.11 | 101.85,23.11 98.04,23.11 | 98.04,23.11 95.76,23.11 92.71,26.16 87.63,26.16 | C2.1 105.16,23.11 | C1.1 101.85,23.11 | PWR.1 98.04,23.11 | 105.16,23.11 106.17,23.11 107.92,24.86 USB.1 | 87.63,26.16 68.58,26.16 | 68.58,26.16 68.07,26.16 | 68.07,26.16 66.04,26.16 | 66.04,26.16 44.7,26.16 | 44.7,26.16 v27.69,26.16 | H2.1.7 25.15,5.33 | H2.1.8 23.11,2.79 23.11,5.33 | H1.1.8 23.11,31.75 | 23.11,31.75 23.11,30.73 v27.69,26.16 | H1.1.7 25.15,34.29 25.15,39.37 25.15,44.45 25.15,46.99 | H2.1.3 25.15,15.49 | 66.04,31.75 66.04,26.17 66.04,26.16 | 28.19,26.17 v27.69,26.16 | H2.1.1 25.15,20.57 25.15,23.62 v27.69,26.16 | 23.11,31.75 23.11,36.83 23.11,41.91 23.11,46.99 25.15,46.99 | 25.15,49.53 25.15,46.99 | 23.11,18.03 23.11,12.95 23.11,7.87 23.11,5.33 | 25.15,15.49 25.15,10.41 25.15,5.33 | 25.15,20.57 25.15,15.49 | 25.15,5.33 23.11,5.33 | 66.04,2.79 66.04,5.33 | 66.04,5.33 66.04,7.87 66.04,12.95 66.04,18.03 | 68.58,26.16 | 66.04,36.83 66.04,41.91 66.04,46.99 68.08,46.99 | 68.08,34.29 68.08,39.37 68.08,44.45 68.08,46.99 | 68.08,46.99 68.08,49.03 H3.1.1 | H4.1.7 68.07,5.33 | 68.07,5.33 66.04,5.33 | H4.1.5 68.07,10.41 | 68.07,10.41 68.07,5.33 | H4.1.3 68.07,15.49 | 68.07,15.49 68.07,10.41 | 68.07,20.57 68.07,15.49 | H4.1.1 68.07,20.57 | 68.07,20.57 68.07,26.16 | 87.63,26.16 v87.63,28.45 | 87.63,26.16 v87.63,23.88 | v44.7,28.45 44.7,26.16 | v44.7,23.88 44.7,26.16 | S2.2 1.62,28.19 v5.59,28.19 9.55,28.19 S2.1 | S1.2 1.62,36.83 v5.59,36.83 9.55,36.83 S1.1 | S3.2 1.62,19.56 v5.59,19.56 9.55,19.56 S3.1 | S4.2 1.62,10.92 v5.59,10.92 9.55,10.92 S4.1
  Bottom 0.406: v87.63,28.45 85.34,28.45 85.09,28.7 v85.09,45.72 | v87.63,23.88 85.34,23.88 85.09,23.62 v85.09,16.76 | v44.7,28.45 42.42,28.45 42.16,28.7 v42.16,45.72 | v44.7,23.88 42.42,23.88 42.16,23.62 v42.16,16.76 | v5.59,26.16 v27.69,26.16 | v5.59,26.16 v5.59,28.19 v5.59,36.83 | v5.59,26.16 v5.59,19.56 v5.59,10.92

### Text on the board
tPlace: switch group | NAND group #1 | NAND group #3 | GND | http://www.github.com/danpage/nandboard | 5v | NAND group #2 | NAND group #4 | nandboard rev. D.1